# EAGLE design MotherBoardV1 (EAGLE 7.3.0)
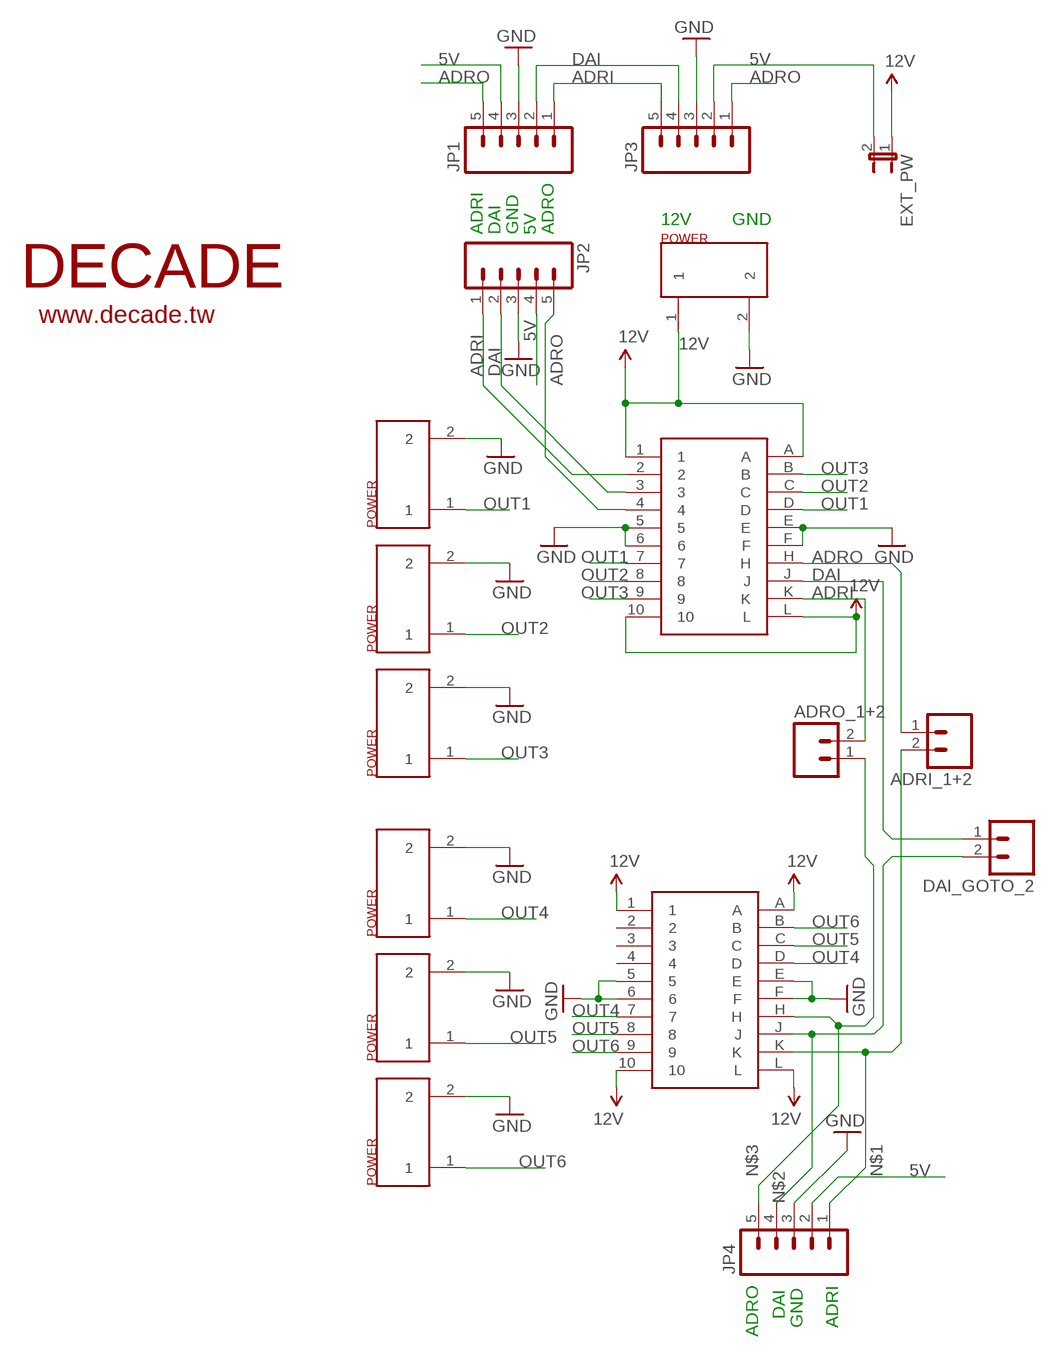
[diagram p0: schematic, sheet 1]

## Parts
ADRI_1+2  M02LOCK  [1X02_LOCK]
ADRO_1+2  M02LOCK  [1X02_LOCK]
DAI_GOTO_2  M02LOCK  [1X02_LOCK]
EXT_PW  JUMPER-2SMD-NO  [SJ_2S-NO]
JP1  M05SCREW  [SCREWTERMINAL-3.5MM-5]
JP2  M05SCREW  [SCREWTERMINAL-3.5MM-5]
JP3  M05SCREW  [SCREWTERMINAL-3.5MM-5]
JP4  M05SCREW  [SCREWTERMINAL-3.5MM-5]
U$1  1X02_POWER_9MM  [1X02_9MM_POWER]
U$2  1X02_POWER_9MM  [1X02_9MM_POWER]
U$3  1X02_POWER_9MM  [1X02_9MM_POWER]
U$4  LW-N10A2G  [LW-N10A2G]
U$5  1X02_POWER_9MM  [1X02_9MM_POWER]
U$6  1X02_POWER_9MM  [1X02_9MM_POWER]
U$7  1X02_POWER_9MM  [1X02_9MM_POWER]
U$8  1X02_POWER_9MM  [1X02_9MM_POWER]
U$9  LW-N10A2G  [LW-N10A2G]
U$11  DECADE-LOGO-SMALL  [DECADE-LOGO-SMALL]

## Nets
5V: EXT_PW.2 JP1.4 JP2.4 JP3.2 JP4.2
12V: EXT_PW.1 U$4.1 U$4.10 U$4.A U$4.L U$5.1 U$9.1 U$9.10 U$9.A U$9.L
ADRI: ADRO_1+2.2 JP1.1 JP2.1 JP3.5 U$4.2 U$4.K
ADRO: ADRI_1+2.1 JP1.5 JP2.5 JP3.1 U$4.4 U$4.H
DAI: DAI_GOTO_2.1 JP1.2 JP2.2 JP3.4 U$4.3 U$4.J
GND: JP1.3 JP2.3 JP3.3 JP4.3 U$1.2 U$2.2 U$3.2 U$4.5 U$4.6 U$4.E U$4.F U$5.2 U$6.2 U$7.2 U$8.2 U$9.5 U$9.6 U$9.E U$9.F
N$1: ADRI_1+2.2 JP4.1 U$9.K
N$2: DAI_GOTO_2.2 JP4.4 U$9.J
N$3: ADRO_1+2.1 JP4.5 U$9.H
OUT1: U$1.1 U$4.7 U$4.D
OUT2: U$2.1 U$4.8 U$4.C
OUT3: U$3.1 U$4.9 U$4.B
OUT4: U$6.1 U$9.7 U$9.D
OUT5: U$7.1 U$9.8 U$9.C
OUT6: U$8.1 U$9.9 U$9.B
Unconnected: U$9.2 U$9.3 U$9.4

## Notes on the sheet
- 12V | GND
- ADRI | DAI | GND | 5V | ADRO
- DAI
- GND | ADRI
- ADRO

## Library data of the parts
ADRI_1+2 ADRO_1+2 DAI_GOTO_2 = SparkFun-Connectors:M02: Standard 2-pin 0.1" header. Use with - straight break away headers ( PRT-00116) - right angle break away headers (PRT-00553) - swiss pins (PRT-00743) - machine pins (PRT-00117) - female headers (PRT-00115) Molex polarized connector foot print use with: PRT-08233 with associated crimp pins and housings. 2.54_SCREWTERM for use with PRT-10571. 3.5mm Screw Terminal footprints for PRT-08084 5mm Screw Terminal footprints for use with PRT-08432
EXT_PW = SparkFun-Retired:JUMPER-2: Jumper Basic 0.1" spaced jumper. Use with breakaway headers.
JP1-JP4 = SparkFun-Connectors:M05: Header 5 Standard 5-pin 0.1" header. Use with straight break away headers (SKU : PRT-00116), right angle break away headers (PRT-00553), swiss pins (PRT-00743), machine pins (PRT-00117), and female headers (PRT-00115). Molex polarized connector foot print use with SKU : PRT-08230 with associated crimp pins and housings.; PROD_ID: Combine 8288+8399
U$1-U$3 U$5-U$8 = DECADE-libraries20151104:1X02_POWER_9MM
U$4 U$9 = DECADE-libraries20151104:LW-N10A2G
U$11 = DECADE-libraries20151104:DECADE-LOGO-SMALL

## Board
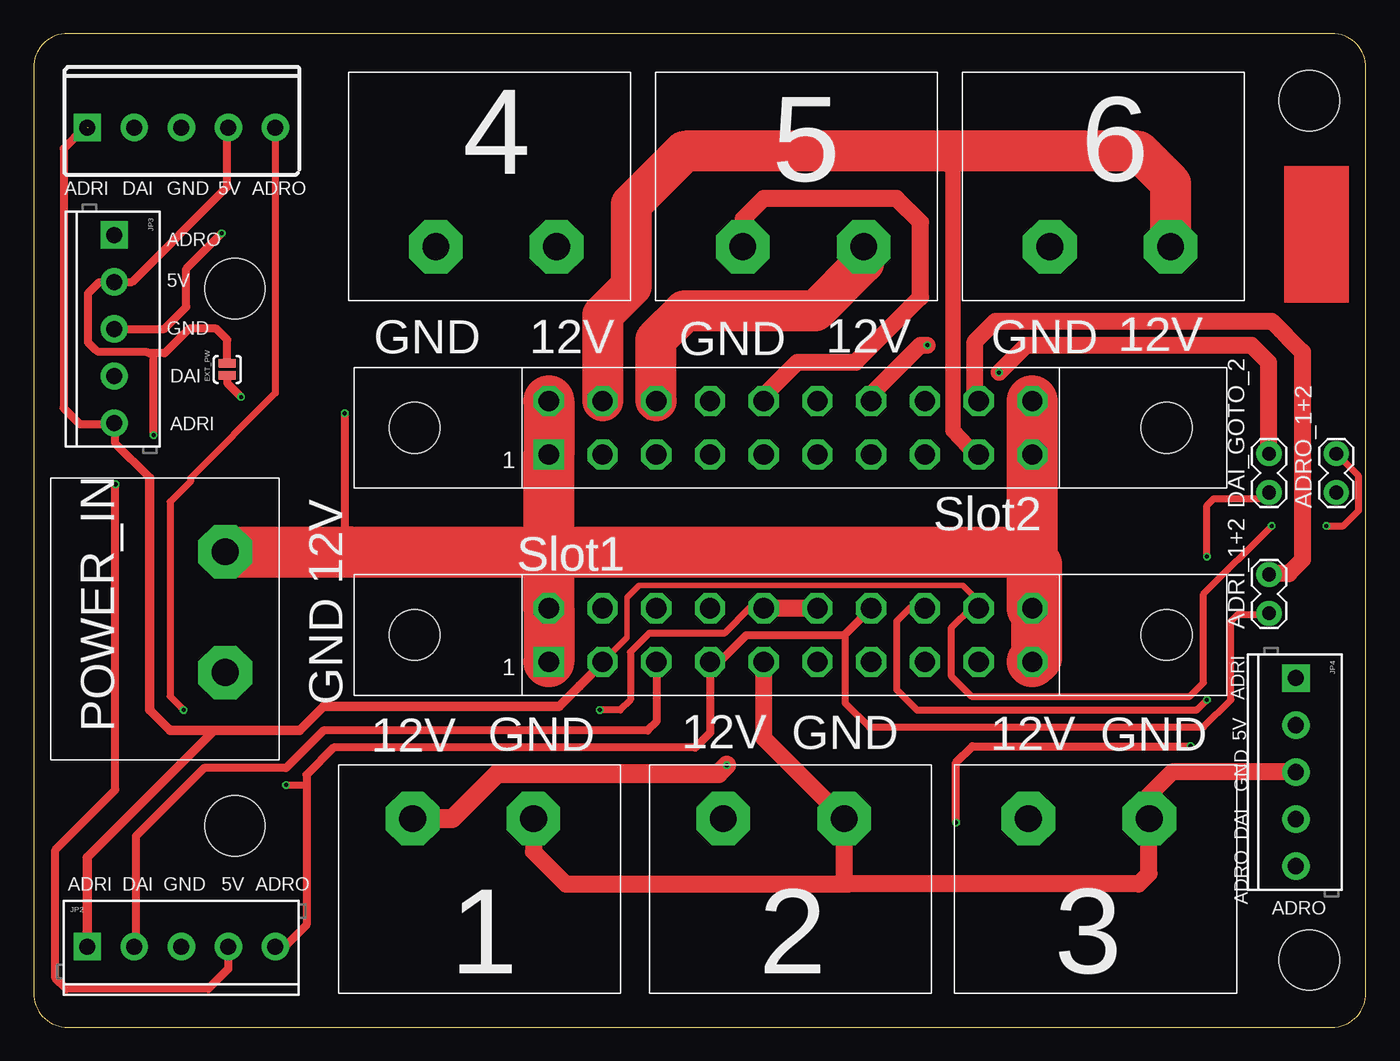
[diagram p1: board, top side]
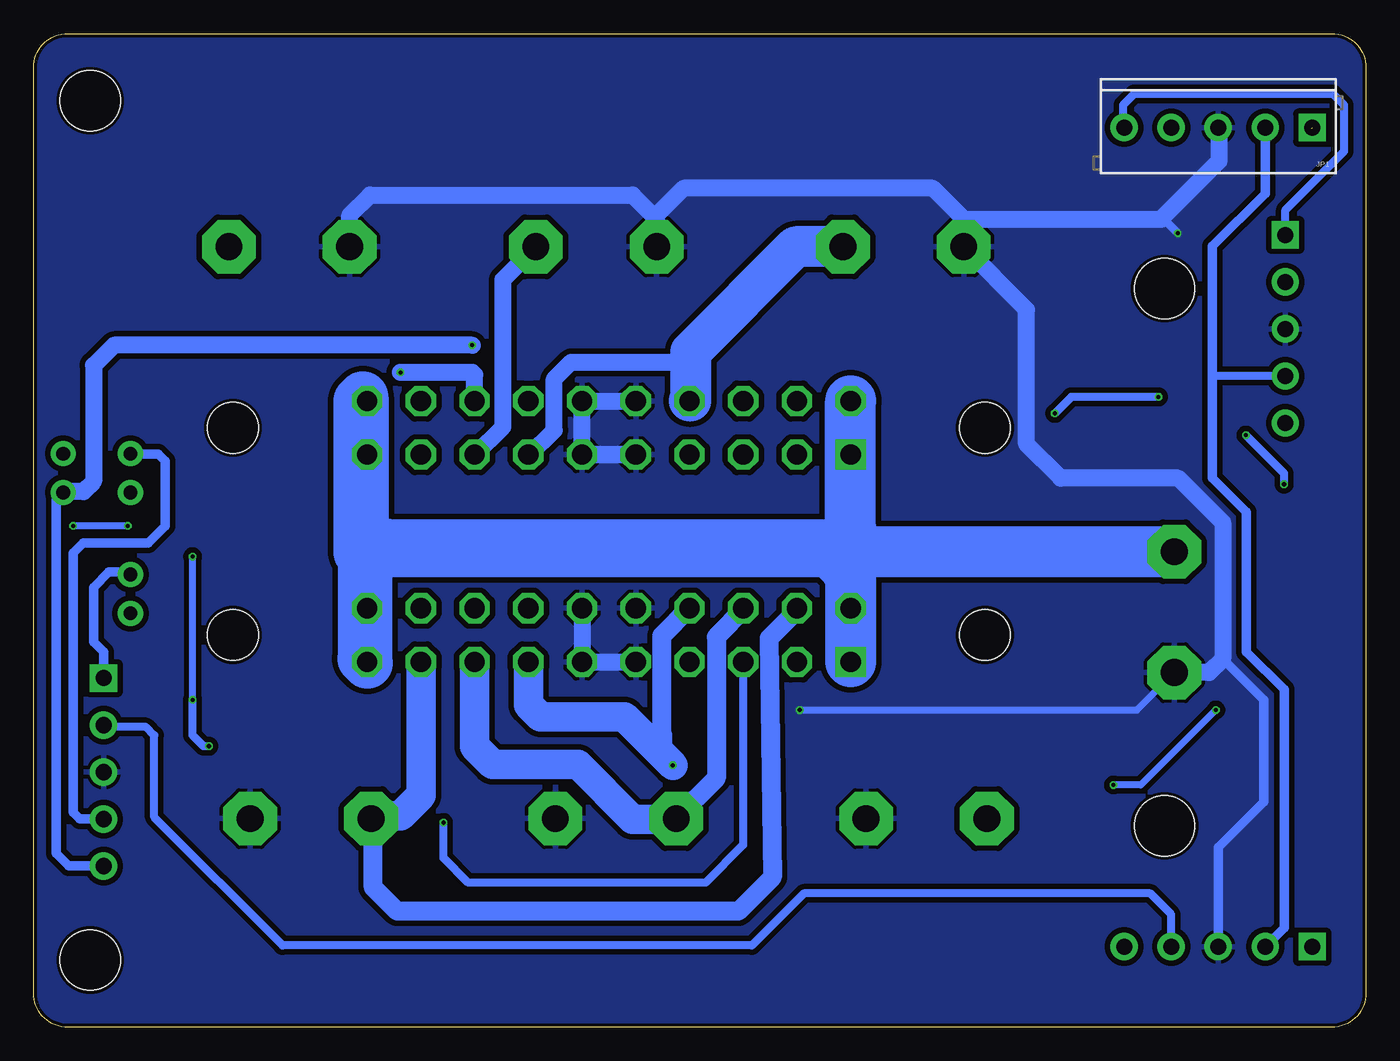
[diagram p2: board, bottom side, seen from below]

Size 99.21 x 74 mm. Coordinates in mm from the lower left corner, seen from the top.
Outline: 0,71.46 0,2.54 arc90 2.54,0 96.67,0 arc90 99.21,2.54 99.21,71.46 arc90 96.67,74 2.54,74 arc90 0,71.46
Copper layers (1*16): Top 0.035mm / dielectric 1.5mm / Bottom 0.035mm
Design rules "ChinaPCB-2015-16mil": minimum track width 12mil, minimum drill 12mil, track to track 16mil, track to pad 16mil, pad to pad 16mil, via to via 16mil, smd to smd 10mil, copper to edge 10mil, drill to drill 15mil, minimum pad ring 12mil, minimum via ring 5mil, stop-mask expansion 4mil, vias tented up to drill 12mil, thermal gap 10mil
Holes 4.5 mm at 15,15 15,55 95,69 95,5

### Footprints (pad centres in the part's own frame; a part is rotated, then mirrored left to right if it is on the bottom)
1X02_LOCK = drill 1.016 pad 1.88: 1 -0.178,0; 2 2.718,0
SJ_2S-NO = smd 0.635 x 1.27: 1 -0.45,0; 2 0.45,0
SCREWTERMINAL-3.5MM-5 = drill 1.2 pad 2.032 square: 1 0,0 | drill 1.2 pad 2.032: 2 3.5,0; 3 7,0; 4 10.5,0; 5 14,0
1X02_9MM_POWER = drill 2 pad 4 octagon: 1 5.5,13; 2 14.5,13
LW-N10A2G = drill 1.5 square: 1 0,0 | drill 1.5 octagon: 2 4,0; 3 8,0; 4 12,0; 5 16,0; 6 20,0; 7 24,0; 8 28,0; 9 32,0; 10 36,0; A 0,4; B 4,4; C 8,4; D 12,4; E 16,4; F 20,4; H 24,4; J 28,4; K 32,4; L 36,4 | hole 3.8: 46,2; -10,2

### Placement (x,y rotation side)
ADRI_1+2  92,31 90 top
ADRO_1+2  97,40 90 top
DAI_GOTO_2  92,40 90 top
EXT_PW  14.43,48.99 90 top
JP1  4,67 180 bottom
JP2  4,6 0 top
JP3  6,59 270 top
JP4  94,26 270 top
U$1  22.72,2.54 0 top
U$2  45.86,2.54 0 top
U$3  68.58,2.54 0 top
U$4  38.37,27.21 0 top
U$5  1.27,40.91 270 top
U$6  44.45,71.12 180 top
U$7  67.31,71.12 180 top
U$8  90.17,71.12 180 top
U$9  38.37,42.64 0 top
U$11  98,54 90 top

### Tracks (layer width: path | path; a pad name or v marks a point on that pad's centre or on a via)
5V  (via drill 0.3)
  Top 0.61: EXT_PW.2 14.43,51.21 13.61,52.02 11.58,52.02 9.75,50.19 8.74,50.19 | 8.74,50.19 8.61,50.19 8.38,50.29 4.83,50.29 4.62,50.44 4.06,51 4.06,54.66 4.88,55.47 5.97,55.47 JP3.2 7.34,55.5 14.43,62.59 14.43,66.93 JP1.4 | JP2.4 14.5,4.34 13.01,2.85 2.44,2.85 1.63,3.66 1.63,13.21 6.1,17.68 v6.1,40.44 | v8.94,44.09 8.94,49.99 8.74,50.19
  Bottom 0.61: v6.1,40.44 6.1,41.25 v8.94,44.09 | JP2.4 14.5,8.4 16.05,9.96 41.86,9.96 45.72,6.1 80.67,6.1 90.22,15.65 90.22,21.74 90.83,22.35 93.85,22.35 JP4.2
12V  (via drill 0.3)
  Top 0.61: EXT_PW.1 14.43,47.95 v15.44,46.94 | v23.16,45.72 23.16,35.82 23.57,35.41
  Top 3.81: U$5.1 23.57,35.41 73.71,35.41 74.68,34.44 74.68,31.52 | 74.68,31.52 74.68,27.52 U$4.10 | U$9.L U$9.10 U$4.L 74.68,31.52 | U$4.1 U$4.A U$9.1 U$9.A
  Bottom 0.61: v15.44,46.94 21.95,46.94 v23.16,45.72
  Bottom 3.81: U$5.1 74.93,35.41 74.98,35.36 74.98,46.63 74.68,46.94 74.68,27.43 74.37,27.13 74.37,34.44 72.85,35.97 39.59,35.97 39.59,35.05 38.37,33.83 U$4.1 | 38.37,37.19 U$9.A
ADRI  (via drill 0.3)  (1 unrouted)
  Top 0.406: 70.37,31.74 69.22,32.89 45.09,32.89 44.2,32 44.2,29.04 U$4.2
  Top 0.508: 70.37,31.74 U$4.K 69.82,31.21 68.33,29.72 68.33,26.16 69.85,24.64 86.11,24.64 87.12,25.65 87.12,32.26 v92.2,37.34 | v96.27,37.34 97.54,37.34 98.68,38.48 98.68,41.04 ADRO_1+2.2
  Top 0.61: 8.64,40.89 8.64,40.95 6.1,43.48 6.1,44.9 JP3.5 5.91,44.91 3.45,44.91 2.23,46.13 2.23,65.43 3.74,66.94 4.06,66.94
  Top 0.711: JP2.1 4,12.64 13.46,22.1 | 13.46,22.1 19.81,22.1 21.59,23.88 39.12,23.88 40.64,25.4 42.42,27.16 U$4.2 | 13.46,22.1 10.16,22.1 8.64,23.62 8.64,40.89
  Bottom 0.508: v92.2,37.34 v96.27,37.34
ADRO  (via drill 0.3)
  Top 0.508: 60.79,29.63 60.45,29.29 60.45,24.13 62.23,22.35 87.12,22.35 89.15,24.38 89.15,30.23 89.66,30.73 91.91,30.73 ADRI_1+2.1 | JP1.5 18,47.21 11.68,40.89 11.68,40.64 10.16,39.12 10.16,24.64 v11.18,23.62 | v18.8,18.03 20.32,18.03
  Top 0.61: JP2.5 18.1,6.1 18.8,6.1 20.32,7.62 20.32,18.03 20.32,18.8 22.35,20.83 49.28,20.83 50.37,21.92 U$4.4 51.09,27.21 53.09,29.21 60.37,29.21 60.79,29.63 U$4.H 62.77,31.21 | 91.95,30.77 ADRI_1+2.1
  Bottom 0.508: v11.18,23.62 16.76,18.03 v18.8,18.03
  Bottom 0.61: JP3.1 6,60.85 1.63,65.23 1.63,68.68 2.44,69.49 17.27,69.49 18.09,68.68 18.09,67.08 JP1.5
DAI  (via drill 0.3)
  Top 0.508: U$4.J 65.25,31.21 64.26,30.23 64.26,25.15 65.79,23.62 86.61,23.62 v87.38,24.38 | v87.38,35.05 87.38,38.86 87.88,39.37 91.55,39.37 DAI_GOTO_2.1
  Top 0.61: U$4.3 46.37,22.75 45.72,22.1 21.59,22.1 18.8,19.3 12.7,19.3 7.62,14.22 7.62,6.12 JP2.2 | v68.68,15.24 68.68,19.71 69.9,20.93 v86.16,20.93
  Bottom 0.508: v87.38,24.38 v87.38,35.05
  Bottom 0.61: U$4.3 46.37,13.57 49.17,10.77 66.85,10.77 68.68,12.6 v68.68,15.24 | v86.16,20.93 86.56,20.93 87.38,21.74 v87.38,24.38 | JP3.4 11.29,48.5 11.43,48.36
  Bottom 0.711: JP1.2 7.5,62.1 11.43,58.17 11.43,48.36 11.43,40.89 8.89,38.35 8.89,27.94 6.1,25.15 6.1,7.4 JP2.2
GND  (via drill 0.3)
  Top 0.508: U$4.E 53.31,31.21 51.44,29.34 45.85,29.34 44.45,27.94 44.45,24.38 43.69,23.62 v42.16,23.62
  Top 0.61: JP3.3 9.73,52 11.38,53.65 11.38,56.49 v14.02,59.13
  Top 1.27: U$9.E 54.37,47 56.9,49.53 61.21,49.53 66.04,54.36 66.04,59.94 64.26,61.72 54.36,61.72 52.83,60.2 52.83,58.14 U$7.2 53.04,58.12 53.09,58.17 | U$4.E U$4.F | U$4.5 54.37,21.53 U$2.2 60.36,11.01 60.71,10.67 | U$1.2 37.22,13.07 39.62,10.67 60.71,10.67 | 60.71,10.67 82.3,10.67 83.06,11.43 83.06,15.52 U$3.2 83.08,17.29 84.84,19.05 93.95,19.05 JP4.3
  Bottom 0.508: v42.16,23.62 17.06,23.62 U$5.2
  Bottom 0.61: v14.02,59.13 15.16,60.27
  Bottom 0.711: JP2.3 11,13.38 7.62,16.76 7.62,24.38 10.67,27.43
  Bottom 1.27: U$9.5 U$9.6 | U$9.6 U$9.F U$9.E | U$8.2 75.67,60.47 74.17,61.98 54.61,61.98 52.96,60.33 | 52.96,60.33 52.83,60.2 52.83,58.14 U$7.2 | 29.95,60.18 U$6.2 25.27,53.44 25.27,43.43 22.73,40.89 13.97,40.89 10.67,37.59 10.67,27.43 11.68,26.42 U$5.2 | 29.95,60.18 32.26,62.48 50.8,62.48 52.96,60.33 | 29.95,60.18 15.26,60.18 15.16,60.27 10.92,64.52 10.92,66.92 JP1.3 | U$9.6 54.32,42.64 | U$4.F U$4.6 U$4.5
  pour Bottom: 0.13,74.42 97.92,74.42 100.33,72.01 100.33,1.91 97.79,-0.64 0.76,-0.64 -1.14,1.27 -1.14,73.15
N$1
  Top 1.27: U$9.K 70.37,46.98 70.1,47.24 70.1,51.05 71.63,52.58 92.2,52.58 94.49,50.29 94.49,34.8 93.47,33.78 92.06,33.78 ADRI_1+2.2
  Bottom 0.711: JP4.1 94,27.96 94.74,28.7 94.74,32.77 93.6,33.91 92.19,33.91 ADRI_1+2.2
N$2  (via drill 0.3)
  Top 1.27: v71.88,48.77 73.91,50.8 90.68,50.8 91.95,49.53 91.95,42.77 DAI_GOTO_2.2
  Bottom 0.711: JP4.4 95.76,15.5 96.27,16 96.27,35.31 95.5,36.07 90.68,36.07 89.41,37.34 89.41,42.16 89.92,42.67 91.95,42.67 DAI_GOTO_2.2
  Bottom 1.27: U$9.J 66.37,48.59 66.55,48.77 v71.88,48.77
N$3  (via drill 0.3)
  Top 1.27: U$9.H 62.37,47.13 66.04,50.8 v66.55,50.8
  Bottom 0.711: JP4.5 96.58,12 97.54,12.95 97.54,39.29 ADRO_1+2.1
  Bottom 1.27: v66.55,50.8 93.22,50.8 94.74,49.28 94.74,40.64 95.5,39.88 96.94,39.88 ADRO_1+2.1
OUT1  (via drill 0.3)
  Top 1.397: U$1.1 31.19,15.54 34.54,18.9 51,18.9 v51.61,19.51
  Bottom 1.397: 52.43,21.74 52.43,29.15 U$4.D
  Bottom 1.524: 52.43,21.74 52.43,20.32 v51.61,19.51
  Bottom 2.184: U$4.7 62.37,24.02 61.47,23.11 55.22,23.11 v51.61,19.51
OUT2
  Bottom 1.397: U$4.C 46.37,31.1 48.26,29.21 48.26,29.16 48.36,29.06 48.36,18.54 U$2.1
  Bottom 2.184: U$4.8 66.37,20.9 65.02,19.56 58.67,19.56 54.61,15.49 51.41,15.49 U$2.1
OUT3
  Bottom 1.397: U$4.B 42.37,31.04 44.45,28.96 44.2,11.18 46.74,8.64 72.14,8.64 73.91,10.41 73.91,15.37 U$3.1
  Bottom 1.676: 73.87,15.75 U$3.1
  Bottom 2.184: U$4.9 70.37,17.26 71.88,15.75 73.87,15.75
OUT4
  Bottom 1.27: U$9.7 62.26,42.64 60.45,44.45 60.45,48.26 59.18,49.53 50.29,49.53
  Bottom 3.048: U$6.1 42.46,58.12 50.29,50.29 50.29,49.53 50.29,46.72 U$9.D 50.3,46.64 50.29,46.63
OUT5
  Top 3.048: U$7.1 61.81,56.93 58.22,53.34 48.46,53.34 46.33,51.21 46.33,46.68 U$9.C
  Bottom 1.27: U$9.8 66.33,42.64 64.26,44.7 64.26,55.67 U$7.1
OUT6
  Top 1.143: 70.14,42.64 68.45,44.45 68.45,64.97
  Top 1.27: U$9.9 70.14,42.64 | 68.45,64.97 68.07,65.23
  Top 3.048: U$8.1 84.67,62.85 82.3,65.23 68.07,65.23 48.46,65.23 44.5,61.27 44.5,55.17 42.37,53.03 U$9.B

### Text on the board
tPlace: 4 | 4 | 5 | 5 | 6 | ADRI | DAI | GND | 5V | ADRO | ADRO | 5V | GND | 12V | GND | GND | GND | 12V | 12V | DAI | ADRI | Slot2 | Slot1 | Slot1 | 12V | GND | ADRI | GND | GND | GND | POWER_IN | 12V | 12V | 12V | 5V | GND | DAI | ADRI | DAI | GND | 5V | ADRO | ADRO | ADRO | 1 | 2 | 3